# Altium project WEMOSD1R1_MATRIX64X32_RGB.PrjPcb
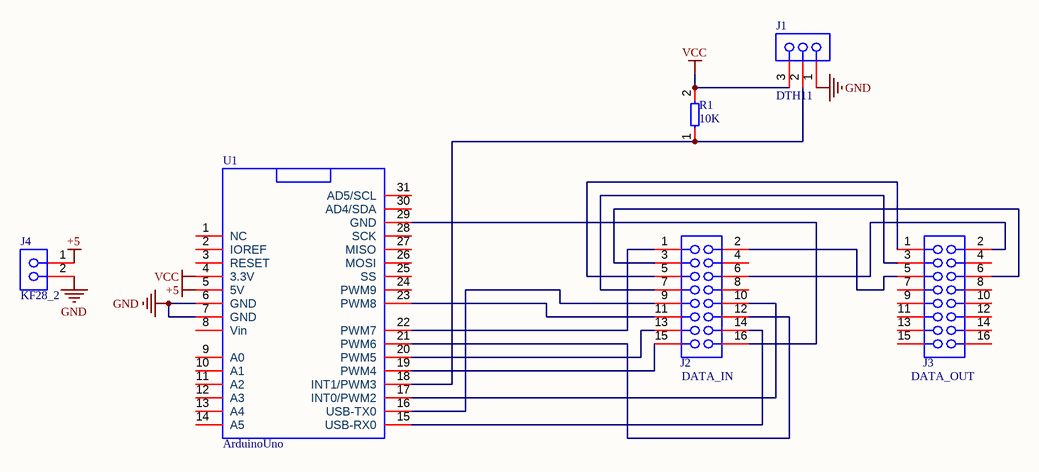
[diagram p0: WEMOSD1R1_MATRIX64X32_RGB.SchDoc]
1 sheet, 6 parts. Net scope: global (net labels, ports and power ports of the same name join across sheets).
Board file: WEMOSD1R1_MATRIX64X32_RGB.PcbDoc

## Sheet WEMOSD1R1_MATRIX64X32_RGB.SchDoc
size A4; SheetNumber: 1; SheetTotal: 1

### Parts
J1  DTH11  [Header 3x1 TH Pitch 2.54mm]
J2  DATA_IN  [Header 8x2 TH Pitch 2.54mm]
J3  DATA_OUT  [Header 8x2 TH Pitch 2.54mm]
J4  KF28_2  [HEADER_KF128_2_5.08MM]
R1  10K  [RES-0.25W-H-MF]
U1  ArduinoUno  [ARDUINO_UNO_PIN_PACK]

### Nets
+5: J4.1 U1.5(5V)
GND: J1.1 J4.2 U1.6(GND) U1.7(GND)
VCC: J1.3 R1.2 U1.4(3.3V)
NetJ1_2: J1.2 R1.1 U1.18(INT1/PWM3)
NetJ2_1: J2.1 U1.22(PWM7)
NetJ2_2: J2.2 J3.5
NetJ2_3: J2.3 J3.6
NetJ2_5: J2.5 J3.1
NetJ2_6: J2.6 J3.2
NetJ2_7: J2.7 J3.3
NetJ2_9: J2.9 U1.16(USB-TX0)
NetJ2_10: J2.10 U1.17(INT0/PWM2)
NetJ2_11: J2.11 U1.23(PWM8)
NetJ2_12: J2.12 U1.21(PWM6)
NetJ2_13: J2.13 U1.20(PWM5)
NetJ2_14: J2.14 U1.15(USB-RX0)
NetJ2_15: J2.15 U1.19(PWM4)
NetJ2_16: J2.16 U1.29(GND)

Not connected (* = marked no-connect by the designer): J2 4 8; J3 4 7 8 9 10 11 12 13 14 15 16; U1 1(NC) 2(IOREF) 3(RESET) 8(Vin) 9(A0) 10(A1) 11(A2) 12(A3) 13(A4) 14(A5) 24(PWM9) 25(SS) 26(MOSI) 27(MISO) 28(SCK) 30(AD4/SDA) 31(AD5/SCL)

### Library data of the parts
J1 = Header 3x1 TH Pitch 2.54mm
J2 J3 = Header 8x2 TH Pitch 2.54mm
J4 = HEADER_KF128_2_5.08MM
R1 = Resistors THD